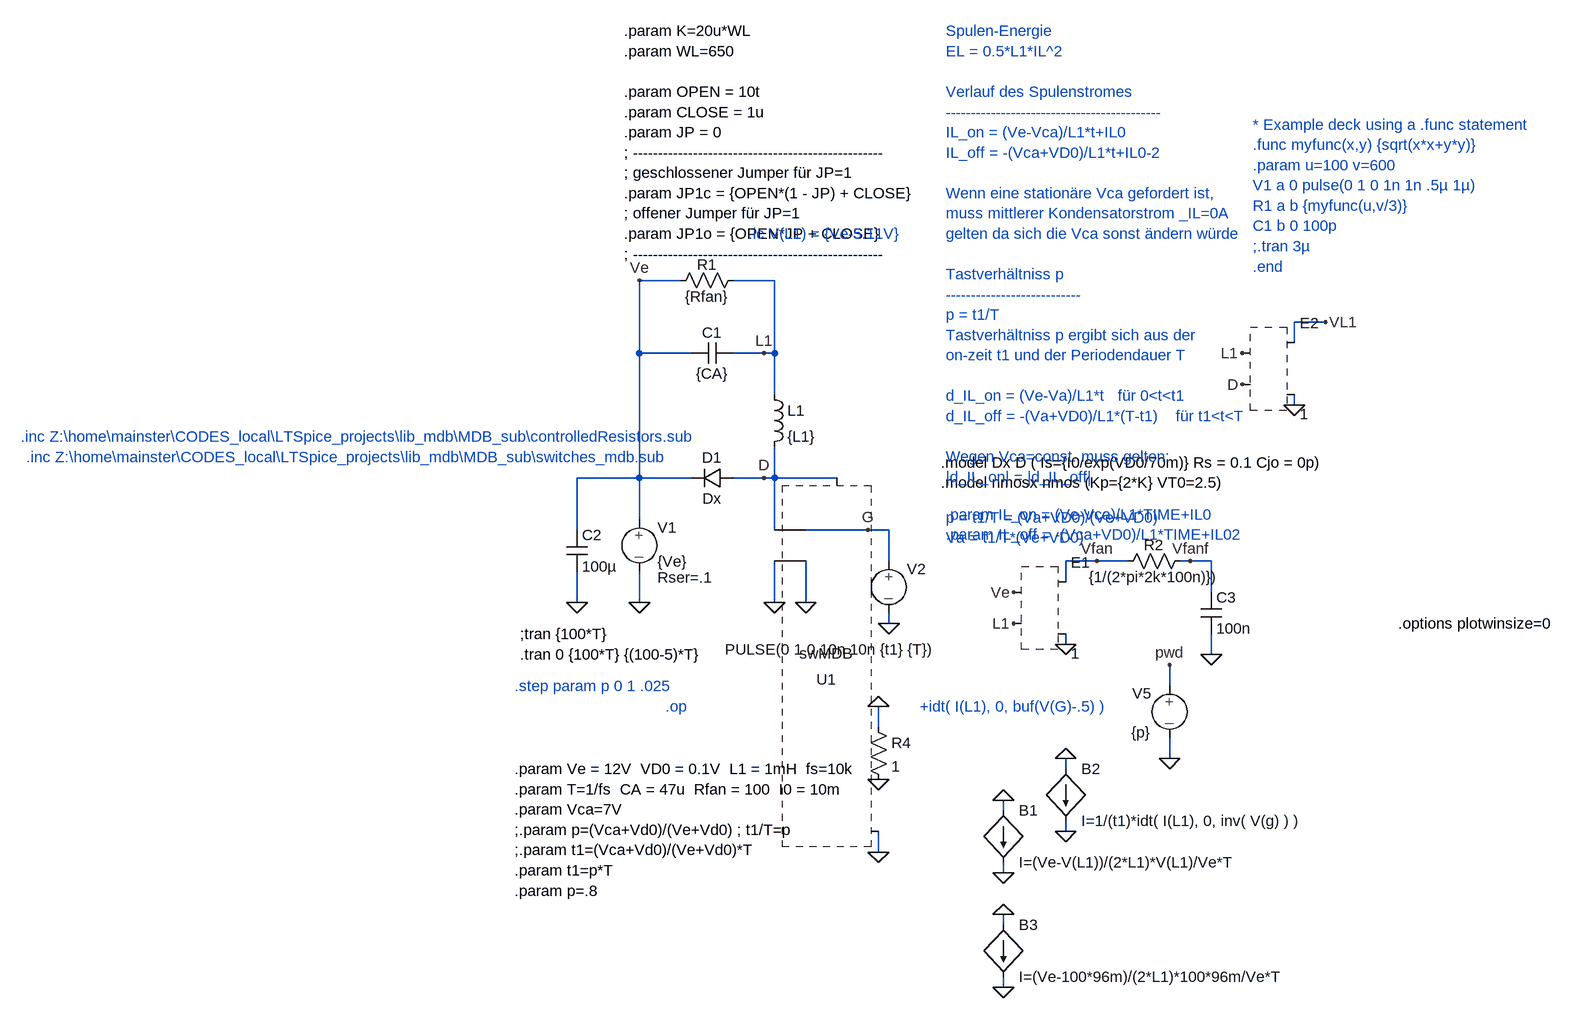
[diagram p0: schematic ws13_14_buck_fan.asc]
ws13_14_buck_fan.asc, the LTspice schematic file:
Version 4
SHEET 1 2024 1060
WIRE 160 -208 96 -208
WIRE 304 -208 240 -208
WIRE 1152 -144 1104 -144
WIRE 1104 -112 1104 -144
WIRE 96 -96 96 -208
WIRE 176 -96 96 -96
WIRE 288 -96 240 -96
WIRE 304 -96 304 -208
WIRE 304 -96 288 -96
WIRE 304 -32 304 -96
WIRE 1104 -16 1104 -32
WIRE 96 96 96 -96
WIRE 96 96 0 96
WIRE 176 96 96 96
WIRE 288 96 240 96
WIRE 304 96 304 48
WIRE 304 96 288 96
WIRE 400 96 304 96
WIRE 96 160 96 96
WIRE 0 176 0 96
WIRE 304 176 304 96
WIRE 448 176 352 176
WIRE 480 176 448 176
WIRE 480 224 480 176
WIRE 800 224 752 224
WIRE 848 224 800 224
WIRE 944 224 928 224
WIRE 976 224 944 224
WIRE 752 256 752 224
WIRE 976 272 976 224
WIRE 0 288 0 240
WIRE 96 288 96 240
WIRE 304 288 304 224
WIRE 352 288 352 224
WIRE 480 320 480 304
WIRE 752 352 752 336
WIRE 976 368 976 336
WIRE 912 416 912 384
WIRE 464 480 464 448
WIRE 912 528 912 496
WIRE 752 544 752 528
WIRE 656 608 656 592
WIRE 752 640 752 624
WIRE 464 672 464 640
WIRE 656 704 656 688
WIRE 656 784 656 768
WIRE 656 880 656 864
FLAG 304 288 0
FLAG 96 288 0
FLAG 480 320 0
FLAG 96 -208 Ve
FLAG 288 -96 L1
FLAG 352 288 0
FLAG 448 176 G
FLAG 288 96 D
FLAG 464 672 0
FLAG 464 448 0
FLAG 0 288 0
FLAG 464 560 0
FLAG 912 528 0
FLAG 912 384 pwd
FLAG 752 352 0
FLAG 672 272 Ve
FLAG 672 320 L1
FLAG 800 224 Vfan
FLAG 976 368 0
FLAG 944 224 Vfanf
FLAG 752 640 0
FLAG 1104 -16 0
FLAG 1152 -144 VL1
FLAG 1024 -96 L1
FLAG 1024 -48 D
FLAG 656 704 0
FLAG 656 592 0
FLAG 752 528 0
FLAG 656 880 0
FLAG 656 768 0
SYMBOL source-V 96 144 R0
WINDOW 123 0 0 Left 2
WINDOW 39 28 105 Left 2
SYMATTR SpiceLine Rser=.1
SYMATTR InstName V1
SYMATTR Value {Ve}
SYMBOL diode 240 80 R90
WINDOW 0 0 32 VBottom 2
WINDOW 3 32 32 VTop 2
SYMATTR InstName D1
SYMATTR Value Dx
SYMBOL ind 288 -48 R0
SYMATTR InstName L1
SYMATTR Value {L1}
SYMBOL res 144 -192 R270
WINDOW 0 25 56 VTop 2
WINDOW 3 7 56 VBottom 2
SYMATTR InstName R1
SYMATTR Value {Rfan}
SYMBOL cap 176 -80 R270
WINDOW 0 32 32 VTop 2
WINDOW 3 0 32 VBottom 2
SYMATTR InstName C1
SYMATTR Value {CA}
SYMBOL source-V 480 208 R0
WINDOW 3 -252 152 Left 2
WINDOW 123 0 0 Left 2
WINDOW 39 0 0 Left 2
SYMATTR Value PULSE(0 1 0 10n 10n {t1} {T})
SYMATTR InstName V2
SYMBOL res 448 464 R0
SYMATTR InstName R4
SYMATTR Value 1
SYMBOL cap -16 176 R0
SYMATTR InstName C2
SYMATTR Value 100µ
SYMBOL source-V 912 400 M0
WINDOW 3 29 88 Left 2
WINDOW 123 0 0 Left 2
WINDOW 39 0 0 Left 2
SYMATTR Value {p}
SYMATTR InstName V5
SYMBOL crtl-V-V 752 240 R0
SYMATTR InstName E1
SYMATTR Value 1
SYMBOL res 832 240 R270
WINDOW 0 25 56 VTop 2
WINDOW 3 7 56 VBottom 2
SYMATTR InstName R2
SYMATTR Value {1/(2*pi*2k*100n)})
SYMBOL cap 960 272 R0
SYMATTR InstName C3
SYMATTR Value 100n
SYMBOL bi 752 544 R0
SYMATTR InstName B2
SYMATTR Value I=1/(t1)*idt( I(L1), 0, inv( V(g) ) )
SYMBOL crtl-V-V 1104 -128 R0
SYMATTR InstName E2
SYMATTR Value 1
SYMBOL MDB_sym\\swMDB 320 208 R180
SYMATTR InstName U1
SYMBOL bi 656 608 R0
SYMATTR InstName B1
SYMATTR Value I=(Ve-V(L1))/(2*L1)*V(L1)/Ve*T
SYMBOL bi 656 784 R0
SYMATTR InstName B3
SYMATTR Value I=(Ve-100*96m)/(2*L1)*100*96m/Ve*T
TEXT -96 544 Left 2 !.param Ve = 12V  VD0 = 0.1V  L1 = 1mH  fs=10k\n.param T=1/fs  CA = 47u  Rfan = 100  I0 = 10m\n.param Vca=7V\n;.param p=(Vca+Vd0)/(Ve+Vd0) ; t1/T=p\n;.param t1=(Vca+Vd0)/(Ve+Vd0)*T\n.param t1=p*T\n.param p=.8
TEXT -88 336 Left 2 !;tran {100*T}
TEXT 560 72 Left 2 !.model Dx D ( Is={I0/exp(VD0/70m)} Rs = 0.1 Cjo = 0p)\n.model nmosx nmos (Kp={2*K} VT0=2.5)
TEXT 72 -592 Left 2 !.param K=20u*WL\n.param WL=650\n \n.param OPEN = 10t\n.param CLOSE = 1u\n.param JP = 0\n; --------------------------------------------------\n; geschlossener Jumper für JP=1\n.param JP1c = {OPEN*(1 - JP) + CLOSE} \n; offener Jumper für JP=1  \n.param JP1o = {OPEN*JP + CLOSE}\n; --------------------------------------------------
TEXT 264 -280 Left 2 ;.ic V(L1) = {Ve-5.11V}
TEXT 568 -592 Left 2 ;Spulen-Energie \nEL = 0.5*L1*IL^2\n \nVerlauf des Spulenstromes\n-------------------------------------------\nIL_on = (Ve-Vca)/L1*t+IL0\nIL_off = -(Vca+VD0)/L1*t+IL0-2\n \nWenn eine stationäre Vca gefordert ist,\nmuss mittlerer Kondensatorstrom _IL=0A\ngelten da sich die Vca sonst ändern würde\n \nTastverhältniss p\n---------------------------\np = t1/T  \nTastverhältniss p ergibt sich aus der \non-zeit t1 und der Periodendauer T\n \nd_IL_on = (Ve-Va)/L1*t   für 0<t<t1\nd_IL_off = -(Va+VD0)/L1*(T-t1)    für t1<t<T\n \nWegen Vca=const. muss gelten:\n|d_IL_on| = |d_IL_off|\n \np = t1/T = (Va+VD0)/(Ve+VD0)\nVa = t1/T*(Ve+VD0)
TEXT 568 152 Left 2 ;.param IL_on = (Ve-Vca)/L1*TIME+IL0\n.param IL_off = -(Vca+VD0)/L1*TIME+IL02
TEXT 528 448 Left 2 ;+idt( I(L1), 0, buf(V(G)-.5) )
TEXT -88 368 Left 2 !.tran 0 {100*T} {(100-5)*T}
TEXT 136 448 Left 2 ;.op
TEXT -96 416 Left 2 ;.step param p 0 1 .025
TEXT 1040 -448 Left 2 ;* Example deck using a .func statement\n.func myfunc(x,y) {sqrt(x*x+y*y)}\n.param u=100 v=600\nV1 a 0 pulse(0 1 0 1n 1n .5µ 1µ)\nR1 a b {myfunc(u,v/3)}\nC1 b 0 100p\n;.tran 3µ\n.end
TEXT -848 64 Left 2 ;.inc Z:\\home\\mainster\\CODES_local\\LTSpice_projects\\lib_mdb\\MDB_sub\\switches_mdb.sub
TEXT -856 32 Left 2 ;.inc Z:\\home\\mainster\\CODES_local\\LTSpice_projects\\lib_mdb\\MDB_sub\\controlledResistors.sub
TEXT 1264 320 Left 2 !.options plotwinsize=0

The netlist it stands for:
* ws13_14_buck_fan.asc
V1 Ve 0 {Ve} Rser=.1
D1 D Ve Dx
L1 L1 D {L1}
R1 Ve L1 {Rfan}
C1 Ve L1 {CA}
V2 G 0 PULSE(0 1 0 10n 10n {t1} {T})
R4 0 0 1
C2 Ve 0 100µ
V5 pwd 0 {p}
* E1: 1 (symbol crtl-V-V not available, pin order unknown); nets seen at it: 0, L1, Ve, Vfan
R2 Vfan Vfanf {1/(2*pi*2k*100n)})
C3 Vfanf 0 100n
B2 0 0 I=1/(t1)*idt( I(L1), 0, inv( V(g) ) )
* E2: 1 (symbol crtl-V-V not available, pin order unknown); nets seen at it: 0, D, L1, VL1
* U1: swMDB (symbol MDB_sym\swMDB not available, pin order unknown); nets seen at it: 0, D, G
B1 0 0 I=(Ve-V(L1))/(2*L1)*V(L1)/Ve*T
B3 0 0 I=(Ve-100*96m)/(2*L1)*100*96m/Ve*T
.model D D
.lib standard.dio
.param Ve = 12V  VD0 = 0.1V  L1 = 1mH  fs=10k
.param T=1/fs  CA = 47u  Rfan = 100  I0 = 10m
.param Vca=7V
;.param p=(Vca+Vd0)/(Ve+Vd0) ; t1/T=p
;.param t1=(Vca+Vd0)/(Ve+Vd0)*T
.param t1=p*T
.param p=.8
;tran {100*T}
.model Dx D ( Is={I0/exp(VD0/70m)} Rs = 0.1 Cjo = 0p)
.model nmosx nmos (Kp={2*K} VT0=2.5)
.param K=20u*WL
.param WL=650
.param OPEN = 10t
.param CLOSE = 1u
.param JP = 0
; --------------------------------------------------
; geschlossener Jumper für JP=1
.param JP1c = {OPEN*(1 - JP) + CLOSE}
; offener Jumper für JP=1
.param JP1o = {OPEN*JP + CLOSE}
; --------------------------------------------------
* .ic V(L1) = {Ve-5.11V}
* Spulen-Energie
* EL = 0.5*L1*IL^2
* Verlauf des Spulenstromes
* -------------------------------------------
* IL_on = (Ve-Vca)/L1*t+IL0
* IL_off = -(Vca+VD0)/L1*t+IL0-2
* Wenn eine stationäre Vca gefordert ist,
* muss mittlerer Kondensatorstrom _IL=0A
* gelten da sich die Vca sonst ändern würde
* Tastverhältniss p
* ---------------------------
* p = t1/T
* Tastverhältniss p ergibt sich aus der
* on-zeit t1 und der Periodendauer T
* d_IL_on = (Ve-Va)/L1*t   für 0<t<t1
* d_IL_off = -(Va+VD0)/L1*(T-t1)    für t1<t<T
* Wegen Vca=const. muss gelten:
* |d_IL_on| = |d_IL_off|
* p = t1/T = (Va+VD0)/(Ve+VD0)
* Va = t1/T*(Ve+VD0)
* .param IL_on = (Ve-Vca)/L1*TIME+IL0
* .param IL_off = -(Vca+VD0)/L1*TIME+IL02
* +idt( I(L1), 0, buf(V(G)-.5) )
.tran 0 {100*T} {(100-5)*T}
* .op
* .step param p 0 1 .025
* * Example deck using a .func statement
* .func myfunc(x,y) {sqrt(x*x+y*y)}
* .param u=100 v=600
* V1 a 0 pulse(0 1 0 1n 1n .5µ 1µ)
* R1 a b {myfunc(u,v/3)}
* C1 b 0 100p
* ;.tran 3µ
* .end
* .inc Z:\home\mainster\CODES_local\LTSpice_projects\lib_mdb\MDB_sub\switches_mdb.sub
* .inc Z:\home\mainster\CODES_local\LTSpice_projects\lib_mdb\MDB_sub\controlledResistors.sub
.options plotwinsize=0
.backanno
.end